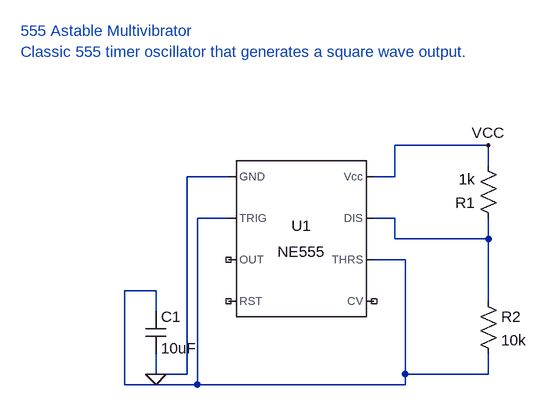
[diagram p0: schematic 555_astable_multivibrator.asc]
555_astable_multivibrator.asc, the LTspice schematic file:
Version 4
SHEET 1 1200 800
TEXT 16 16 Left 2 ;555 Astable Multivibrator
TEXT 16 48 Left 2 ;Classic 555 timer oscillator that generates a square wave output.
SYMBOL Misc\NE555 448 336 R0
SYMATTR InstName U1
SYMATTR Value NE555
SYMBOL res 752 320 R180
SYMATTR InstName R1
SYMATTR Value 1k
SYMBOL res 720 416 R0
SYMATTR InstName R2
SYMATTR Value 10k
SYMBOL cap 208 448 R0
SYMATTR InstName C1
SYMATTR Value 10uF
FLAG 736 192 VCC
WIRE 560 240 592 240
WIRE 592 192 592 240
WIRE 592 192 736 192
WIRE 736 192 736 224
FLAG 224 544 0
WIRE 224 512 224 544
WIRE 224 544 272 544
WIRE 272 240 272 544
WIRE 272 240 304 240
WIRE 304 240 336 240
WIRE 176 416 176 560
WIRE 176 416 224 416
WIRE 176 560 288 560
WIRE 224 416 224 448
WIRE 288 304 288 560
WIRE 288 304 304 304
WIRE 288 560 608 560
WIRE 304 304 336 304
WIRE 560 368 592 368
WIRE 592 368 608 368
WIRE 608 368 608 544
WIRE 608 544 608 560
WIRE 608 544 736 544
WIRE 736 512 736 544
WIRE 560 304 592 304
WIRE 592 304 592 336
WIRE 592 336 736 336
WIRE 736 304 736 336
WIRE 736 336 736 400
WIRE 736 400 736 432

The netlist it stands for:
* 555_astable_multivibrator.asc
XU1 0 N001 NC_01 NC_02 NC_03 N001 N002 VCC NE555  ; pins GND TRIG OUT RST CV THRS DIS Vcc
R1 N002 VCC 1k
R2 N002 N001 10k
C1 N001 0 10uF
* 555 Astable Multivibrator
* Classic 555 timer oscillator that generates a square wave output.
.lib NE555.sub
.backanno
.end